# Altium schematic sheet BMS Slave Rev 1.SchDoc
size A4; SheetNumber: 1; SheetTotal: 7
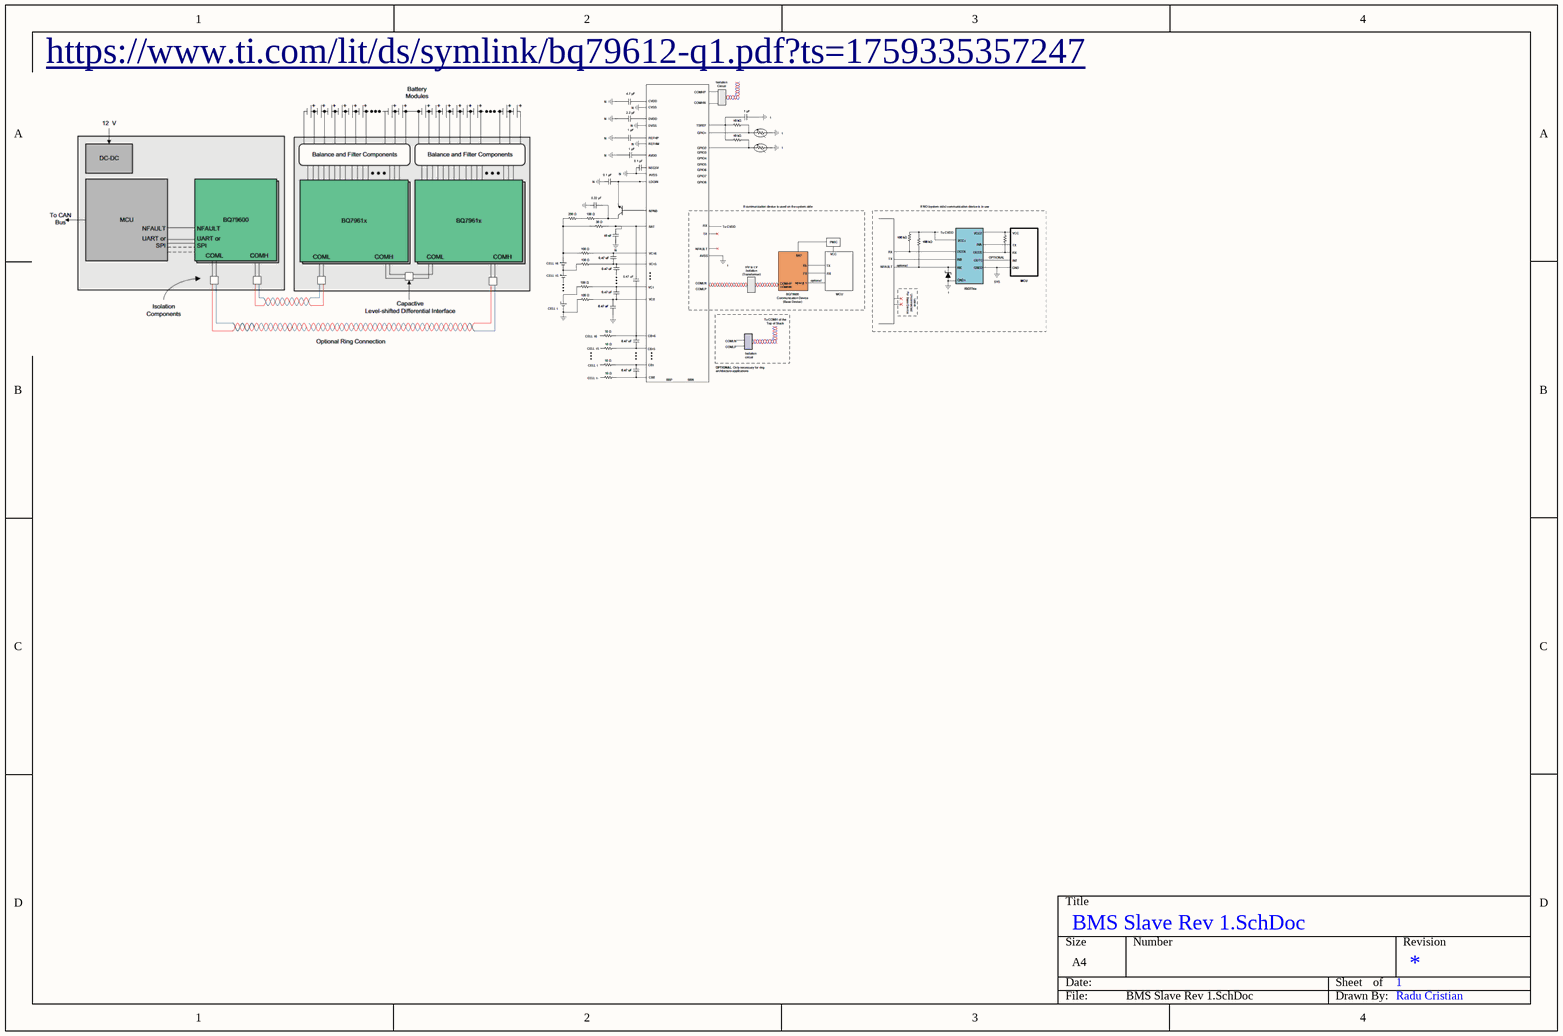
[diagram p0: BMS Slave Rev 1.SchDoc]

## Notes on the sheet
- https://www.ti.com/lit/ds/symlink/bq79612-q1.pdf?ts=1759335357247
- Radu Cristian